# Altium schematic sheet analog_backend.SchDoc: Analog backend
size A4
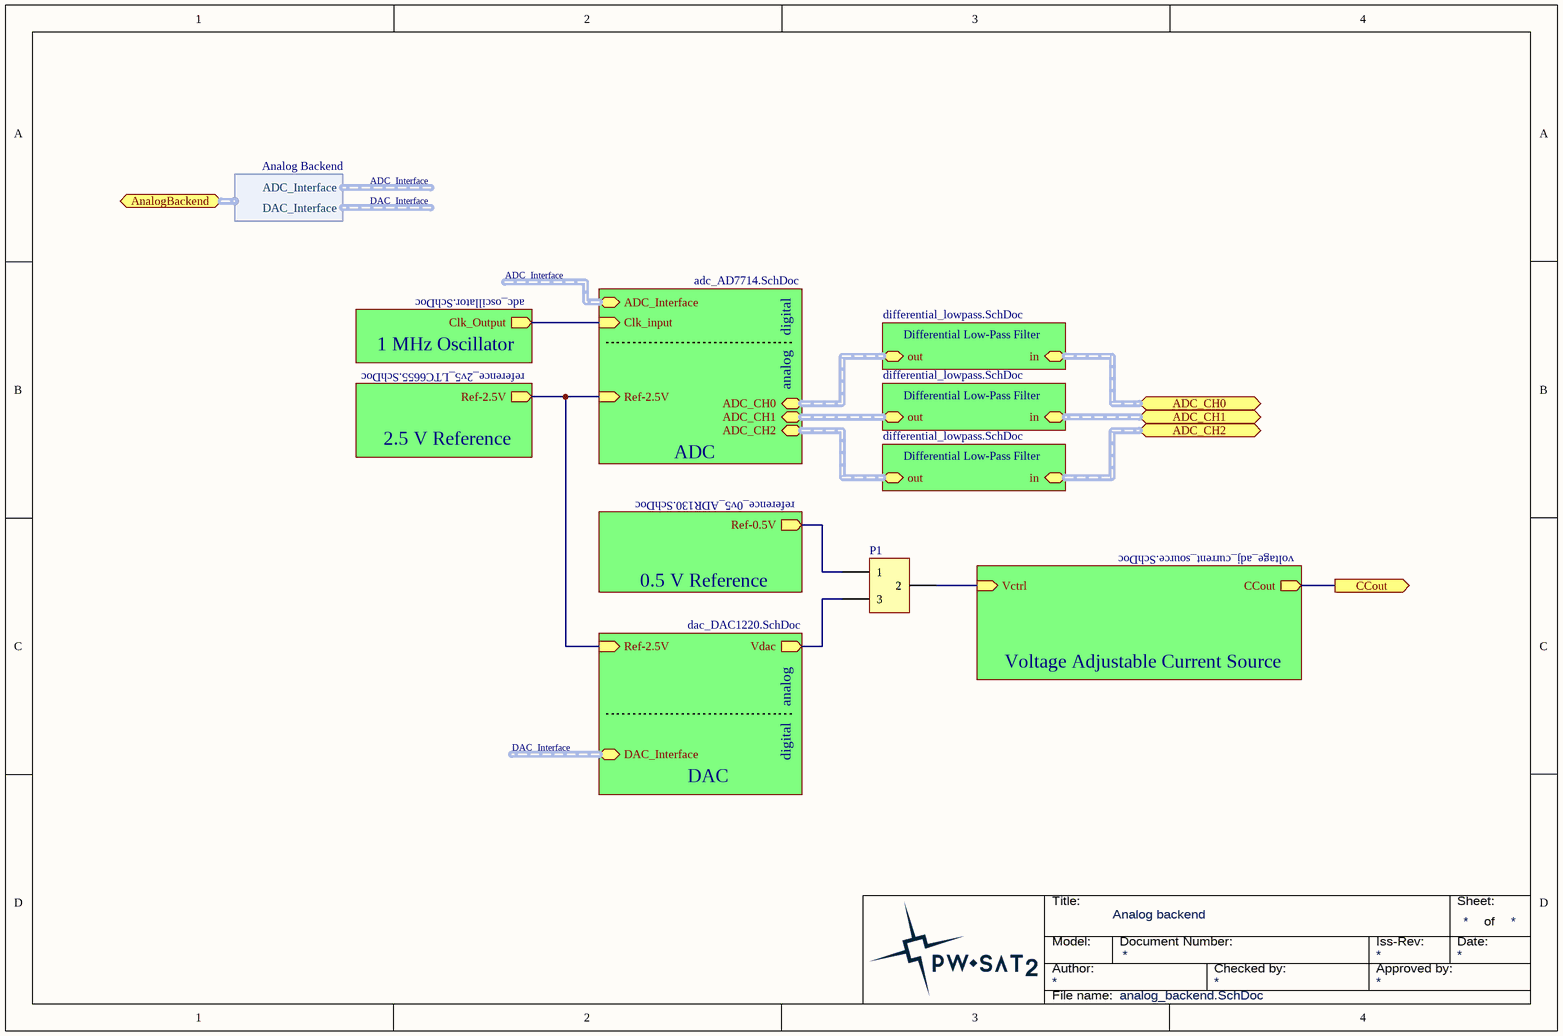
[diagram p0: analog_backend.SchDoc]

## Parts
P1  Option_Header  [HEADER 1X3 MALE]  (value not drawn)

## Sub-sheets
0.5 V Reference = reference_0v5_ADR130.SchDoc: Ref-0.5V (out)
1 MHz Oscillator = adc_oscillator.SchDoc: Clk_Output (out)
2.5 V Reference = reference_2v5_LTC6655.SchDoc: Ref-2.5V (out)
ADC = adc_AD7714.SchDoc: Ref-2.5V (in), ADC_Interface (harness ADC_DIGITAL), ADC_CH1 (harness ADC Channel), ADC_CH2 (harness ADC Channel), ADC_CH0 (harness ADC Channel), Clk_input (in)
DAC = dac_DAC1220.SchDoc: Ref-2.5V (in), DAC_Interface (harness DAC_DIGITAL), Vdac (out)
Differential Low-Pass Filter = differential_lowpass.SchDoc: out (harness ADC Channel), in (harness ADC Channel)
Differential Low-Pass Filter = differential_lowpass.SchDoc: out (harness ADC Channel), in (harness ADC Channel)
Differential Low-Pass Filter = differential_lowpass.SchDoc: out (harness ADC Channel), in (harness ADC Channel)
Voltage Adjustable Current Source = voltage_adj_current_source.SchDoc: Vctrl (in), CCout (out)

## Ports
ADC_CH0, ADC_CH1, ADC_CH2, AnalogBackend (harness Analog Backend), CCout (out)

## Harnesses
Analog Backend: ADC_Interface, DAC_Interface

## Nets
CCout: port CCout, sheet Voltage Adjustable Current Source/CCout
NetP1_1: P1.1 ; sheet 0.5 V Reference/Ref-0.5V
NetP1_2: P1.2 ; sheet Voltage Adjustable Current Source/Vctrl
NetP1_3: P1.3 ; sheet DAC/Vdac
(unnamed): sheet ADC/Ref-2.5V, sheet 2.5 V Reference/Ref-2.5V, sheet DAC/Ref-2.5V
(unnamed): sheet ADC/Clk_input, sheet 1 MHz Oscillator/Clk_Output

## Buses and harness runs
harness ADC_Interface = sheet ADC/ADC_Interface
harness DAC_Interface = sheet DAC/DAC_Interface
harness port ADC_CH0 = sheet Differential Low-Pass Filter/in
harness port ADC_CH1 = sheet Differential Low-Pass Filter/in
harness port ADC_CH2 = sheet Differential Low-Pass Filter/in
harness sheet ADC/ADC_CH0 = sheet Differential Low-Pass Filter/out
harness sheet ADC/ADC_CH1 = sheet Differential Low-Pass Filter/out
harness sheet ADC/ADC_CH2 = sheet Differential Low-Pass Filter/out

## Notes on the sheet
- analog
- digital
- Title:
- Sheet:
- of
- Author:
- Model:
- Document Number:
- Checked by:
- Iss-Rev:
- Approved by:
- Date:
- File name:

## Library data of the parts
P1 = Option_Header: Option Header, 3-Pin; LatestRevisionDate: 17-Jul-2002; LatestRevisionNote: Re-released for DXP Platform.; Publisher: Altium Limited